# Altium schematic sheet TL431.SchDoc
size A4
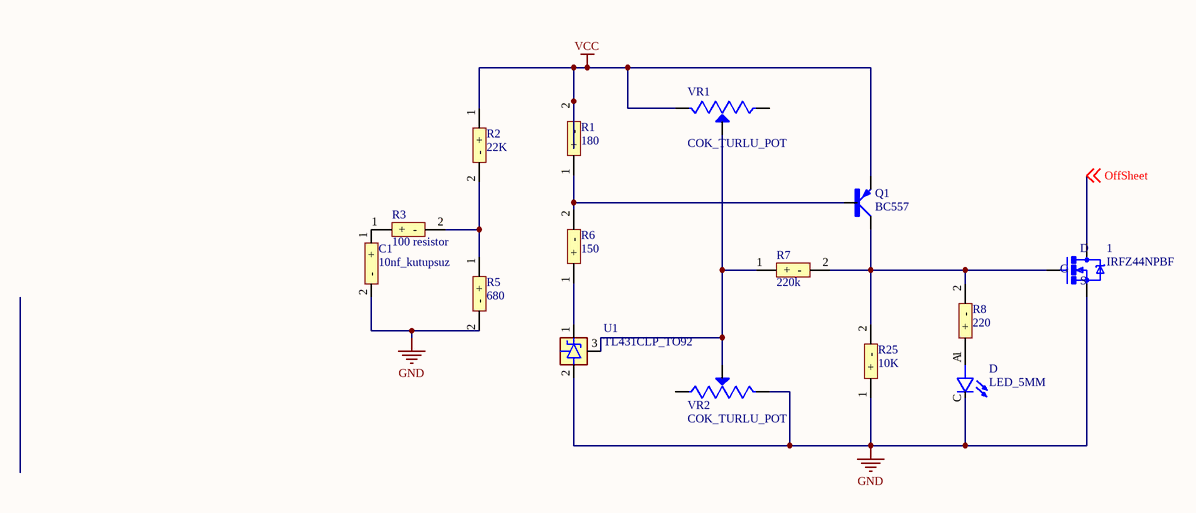
[diagram p0: TL431.SchDoc]

## Parts
1  IRFZ44NPBF  [IRFZ44N]
C1  10nf_kutupsuz  [10NF_KUTUPSUZ]
D  LED_5MM  [LED_5MM]
Q1  BC557  [BC557]
R1  180  [100 resistor]
R2  22K  [100 resistor]
R3  100 resistor  [100 resistor]
R5  680  [100 resistor]
R6  150  [100 resistor]
R7  220k  [100 resistor]
R8  220  [100 resistor]
R25  10K  [100 resistor]
U1  TL431CLP_TO92  [TL432_TO92]
VR1  COK_TURLU_POT  [COK_TURLU_POT]
VR2  COK_TURLU_POT  [COK_TURLU_POT]

## Nets
GND: 1.3(S) C1.2(-) D.C R5.2(-) R25.1(+) U1.2(ANODE) VR2.3(CW)
VCC: Q1.E R1.2(-) R2.1(+) VR1.3(CW)
OffSheet: 1.2(D) ; off-sheet OffSheet
Net1_1: 1.1(G) Q1.C R7.2(-) R8.2(-) R25.2(-)
NetC1_1: C1.1(+) R3.1(+)
NetD_A: D.A R8.1(+)
NetQ1_B: Q1.B R1.1(+) R6.2(-)
NetR2_2: R2.2(-) R3.2(-) R5.1(+)
NetR6_1: R6.1(+) U1.1(CATHODE)
NetR7_1: R7.1(+) U1.3(REF) VR1.2(WIPER) VR2.2(WIPER)

Not connected (* = marked no-connect by the designer): VR1 1(CCW); VR2 1(CCW)

## Library data of the parts
1 = IRFZ44NPBF: RoHS Compliant | Low RDS_on_ | Industry-leading quality | Dynamic dv/dt Rating | Fast Switching | Fully Avalanche Rated | 175C Operating Temperature; MF: Infineon; MP: IRFZ44NPBF; Price: None; SnapEDA_Link: https://www.snapeda.com/parts/IRFZ44NPBF/Infineon%20Technologies/view-part/1662576/?ref=snap; Package: TO-220 Infineon; Value: *; Availability: Unavailable
D = LED_5MM: LED; 5mm; green; 5-32mcd; 60Â°; Front: convex; MF: Kingbright; MP: L-53GD; Availability: Unavailable; SnapEDA_Link: https://www.snapeda.com/parts/L-53GD/Kingbright/view-part/525636/?ref=snap; Price: None; Package: CDIP-28 Kingbright; Value: *
Q1 = BC557: Bipolar _BJT_ Transistor PNP 45V 100mA 150MHz 500mW Through Hole TO-92-3; MF: ON; MP: BC557; Price: None; SnapEDA_Link: https://www.snapeda.com/parts/BC557/ON%20Semiconductor/view-part/681642/?ref=snap; Package: TO-92 Rochester Electronics; Value: *; Availability: Unavailable
R1 R2 R5-R8 R25 = 100 resistor
U1 = TL431CLP_TO92: Adjustable precision shunt regulator 3-TO-92 0 to 70; MF: Texas Instruments; Purchase-URL: https://pricing.snapeda.com/search/part/TL431CLP/?ref=eda; Price: None; Package: TO-92 Texas Instruments; Check_prices: https://www.snapeda.com/parts/TL431CLP/Texas%20Instruments/view-part/4478972/?ref=eda; Value: *; MP: TL431CLP; Availability: Good; SnapEDA_Link: https://www.snapeda.com/parts/TL431CLP/Texas%20Instruments/view-part/4478972/?ref=snap
VR1 VR2 = COK_TURLU_POT: 30 kOhms 0.5W, 1/2W PC Pins Through Hole Trimmer Potentiometer Cermet 25 Turn Top Adjustment; MP: 3296W-1-303; MF: Bourns; Check_prices: https://www.snapeda.com/parts/3296W-1-303/Bourns/view-part/1485011/?ref=eda; Value: *; Availability: Unavailable; Price: None; Package: SOT-23-5 Bourns; SnapEDA_Link: https://www.snapeda.com/parts/3296W-1-303/Bourns/view-part/1485011/?ref=snap